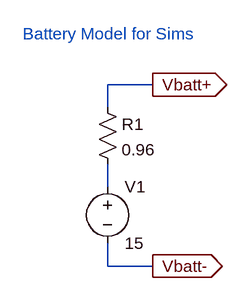
[diagram p0: schematic bat.asc]
bat.asc, the LTspice schematic file:
Version 4
SHEET 1 880 680
WIRE 160 -48 96 -48
WIRE 96 -16 96 -48
WIRE 96 96 96 64
WIRE 96 208 96 176
WIRE 160 208 96 208
FLAG 160 -48 Vbatt+
IOPIN 160 -48 Out
FLAG 160 208 Vbatt-
IOPIN 160 208 Out
SYMBOL voltage 96 80 R0
SYMATTR InstName V1
SYMATTR Value 15
SYMBOL res 80 -32 R0
SYMATTR InstName R1
SYMATTR Value 0.96
TEXT -24 -120 Left 2 ;Battery Model for Sims

The netlist it stands for:
* bat.asc
V1 N001 Vbatt- 15
R1 Vbatt+ N001 0.96
* Battery Model for Sims
.backanno
.end